# Altium schematic sheet ESC3 (1).SchDoc: Sensorless BLDC Controller
size A3; PageSetup: Record=PageOptions|CenterHorizontal=True|CenterVertical=True|PrintScale=0.34|XCorrection=1.00|YCorrection=1.00|PrintKind=1|BorderSize=5000000|LeftOffset=0|BottomOffset=0|Orientation=2|PaperLength=1000|PaperWidth=1000|Scale=100|PaperSource=7|PrintQuality=-3|MediaType=1|DitherType=10|PrintScaleMode=1|PaperKind=A3|PaperIndex=8
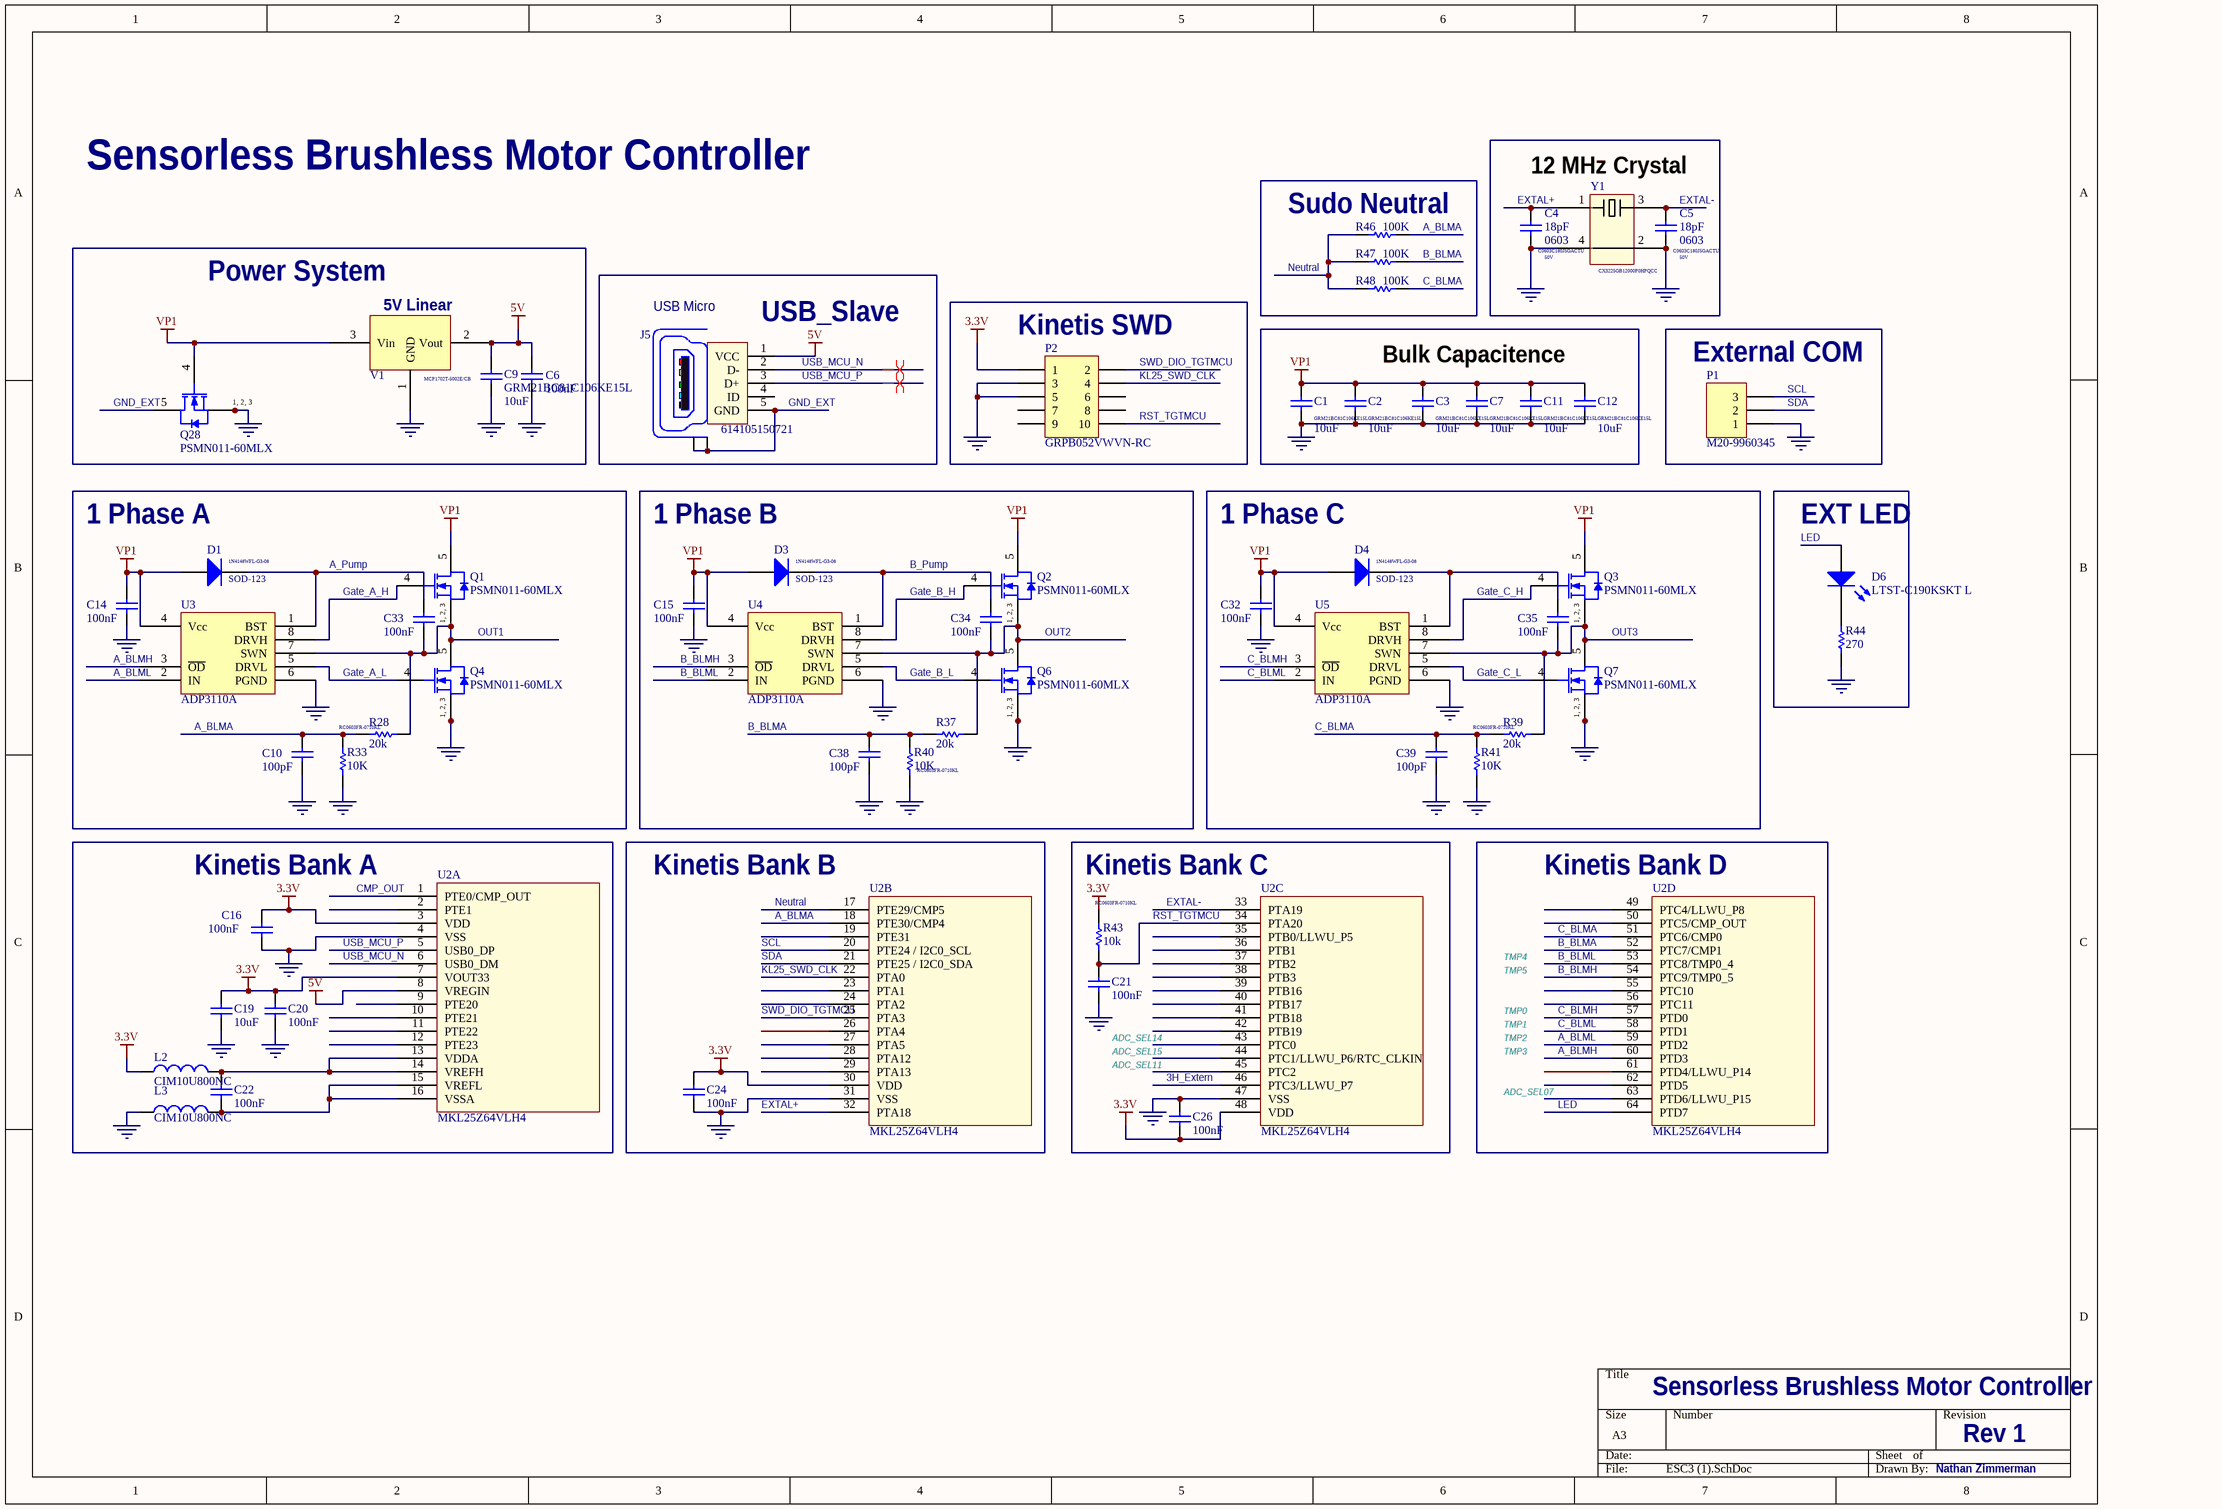
[diagram p0: ESC3 (1).SchDoc]

## Parts
C1  GRM21BC81C106KE15L  value 10uF  [6-0805_MC]
C2  GRM21BC81C106KE15L  value 10uF  [6-0805_MC]
C3  GRM21BC81C106KE15L  value 10uF  [6-0805_MC]
C4  C0603C180J5GACTU  value 18pF  PackageReference: 0603  Voltage: 50V  [1608[0603]C]
C5  C0603C180J5GACTU  value 18pF  PackageReference: 0603  Voltage: 50V  [1608[0603]C]
C6  value 100nF  [1608[0603]C]  (hidden comment: GRM188R71H104KA93D)
C7  GRM21BC81C106KE15L  value 10uF  [6-0805_MC]
C9  GRM21BC81C106KE15L  value 10uF  [6-0805_MC]
C10  value 100pF  [1608[0603]C]  (hidden comment: C1608C0G1H101J080AA)
C11  GRM21BC81C106KE15L  value 10uF  [6-0805_MC]
C12  GRM21BC81C106KE15L  value 10uF  [6-0805_MC]
C14  value 100nF  [1608[0603]C]  (hidden comment: GRM188R71H104KA93D)
C15  value 100nF  [1608[0603]C]  (hidden comment: GRM188R71H104KA93D)
C16  value 100nF  [1608[0603]C]  (hidden comment: GRM188R71H104KA93D)
C19  value 10uF  [6-0805_MC]  (hidden comment: GRM21BC81C106KE15L)
C20  value 100nF  [1608[0603]C]  (hidden comment: GRM188R71H104KA93D)
C21  value 100nF  [1608[0603]C]  (hidden comment: GRM188R71H104KA93D)
C22  value 100nF  [1608[0603]C]  (hidden comment: GRM188R71H104KA93D)
C24  value 100nF  [1608[0603]C]  (hidden comment: GRM188R71H104KA93D)
C26  value 100nF  [1608[0603]C]  (hidden comment: GRM188R71H104KA93D)
C32  value 100nF  [1608[0603]C]  (hidden comment: GRM188R71H104KA93D)
C33  value 100nF  [1608[0603]C]  (hidden comment: GRM188R71H104KA93D)
C34  value 100nF  [1608[0603]C]  (hidden comment: GRM188R71H104KA93D)
C35  value 100nF  [1608[0603]C]  (hidden comment: GRM188R71H104KA93D)
C38  value 100pF  [1608[0603]C]  (hidden comment: C1608C0G1H101J080AA)
C39  value 100pF  [1608[0603]C]  (hidden comment: C1608C0G1H101J080AA)
D1  1N4148WFL-G3-08  PackageReference: SOD-123  [SOD123_3D]
D3  1N4148WFL-G3-08  PackageReference: SOD-123  [SOD123_3D]
D4  1N4148WFL-G3-08  PackageReference: SOD-123  [SOD123_3D]
D6  LTST-C190KSKT L  [1608[0603]LED]
J5  614105150721  [USB_Micro_Vertical]
L2  CIM10U800NC  [1608[0603]L]
L3  CIM10U800NC  [1608[0603]L]
P1  M20-9960345  [HDR1X3]
P2  GRPB052VWVN-RC  [MHDR2X5]
Q1  PSMN011-60MLX  [SOT1210_FET]
Q2  PSMN011-60MLX  [SOT1210_FET]
Q3  PSMN011-60MLX  [SOT1210_FET]
Q4  PSMN011-60MLX  [SOT1210_FET]
Q6  PSMN011-60MLX  [SOT1210_FET]
Q7  PSMN011-60MLX  [SOT1210_FET]
Q28  PSMN011-60MLX  [SOT1210_FET]
R28  value 20k  [1608[0603]R]  (hidden comment: Res1)
R33  RC0603FR-0710KL  value 10K  [1608[0603]R]
R37  value 20k  [1608[0603]R]  (hidden comment: Res1)
R39  value 20k  [1608[0603]R]  (hidden comment: Res1)
R40  RC0603FR-0710KL  value 10K  [1608[0603]R]
R41  RC0603FR-0710KL  value 10K  [1608[0603]R]
R43  RC0603FR-0710KL  value 10k  [1608[0603]R]
R44  value 270  [1608[0603]R]  (hidden comment: Res1)
R46  value 100K  [1608[0603]R]  (hidden comment: Res1)
R47  value 100K  [1608[0603]R]  (hidden comment: Res1)
R48  value 100K  [1608[0603]R]  (hidden comment: Res1)
U2  MKL25Z64VLH4  [LQFP64_10mm_0.5mm]  (parts A,B,C,D of 4)
U3  ADP3110A  [SOIC8_3.9mm_body]
U4  ADP3110A  [SOIC8_3.9mm_body]
U5  ADP3110A  [SOIC8_3.9mm_body]
V1  MCP1702T-5002E/CB  [SOT-23B_M]
Y1  CX3225GB12000P0HPQCC  [3225_Crystal]

## Blocks framed on the sheet
12 MHz Crystal: C4 C5 Y1
Sudo Neutral: R46-R48
Power System: C6 C9 Q28 V1
USB_Slave: J5
Kinetis SWD: P2
Bulk Capacitence: C1-C3 C7 C11 C12
External COM: P1
1 Phase A: C10 C14 C33 D1 Q1 Q4 R28 R33 U3
1 Phase B: C15 C34 C38 D3 Q2 Q6 R37 R40 U4
1 Phase C: C32 C35 C39 D4 Q3 Q7 R39 R41 U5
EXT LED: D6 R44
Kinetis Bank A: C16 C19 C20 C22 L2 L3 U2
Kinetis Bank B: C24 U2
Kinetis Bank C: C21 C26 R43 U2
Kinetis Bank D: U2

## Nets
3.3V: C16.2 C19.1 C20.1 C24.2 C26.1 L2.2 P2.1 R43.2 U2.3(VDD) U2.7(VOUT33) U2.30(VDD) U2.48(VDD)
5V: C6.2 C9.2 J5.1(VCC) U2.8(VREGIN) V1.2(Vout)
GND: C1.1 C2.1 C3.1 C4.1 C5.1 C6.1 C7.1 C9.1 C10.1 C11.1 C12.1 C14.1 C15.1 C16.1 C19.2 C20.2 C21.1 C24.1 C26.2 C32.1 C38.1 C39.1 L3.2 P1.1 P2.3 P2.5 Q4.1(S) Q4.2(S) Q4.3(S) Q6.1(S) Q6.2(S) Q6.3(S) Q7.1(S) Q7.2(S) Q7.3(S) Q28.1(S) Q28.2(S) Q28.3(S) R33.2 R40.2 R41.2 R44.2 U2.4(VSS) U2.31(VSS) U2.47(VSS) U3.6(PGND) U4.6(PGND) U5.6(PGND) V1.1(GND) Y1.2(GND) Y1.4(GND)
VP1: C1.2 C2.2 C3.2 C7.2 C11.2 C12.2 C14.2 C15.2 C32.2 D1.1(A) D3.1(A) D4.1(A) Q1.5(D) Q2.5(D) Q3.5(D) Q28.4(G) U3.4(Vcc) U4.4(Vcc) U5.4(Vcc) V1.3(Vin)
3H_Extern: U2.46(PTC3/LLWU_P7)
A_BLMA: C10.2 R28.2 R33.1 R46.2 U2.18(PTE30/CMP4)
A_BLMH: U2.60(PTD3) U3.3(~{OD})
A_BLML: U2.59(PTD2) U3.2(IN)
A_Pump: C33.2 D1.2(K) U3.1(BST)
B_BLMA: C38.2 R37.2 R40.1 R47.2 U2.52(PTC7/CMP1)
B_BLMH: U2.54(PTC9/TMP0_5) U4.3(~{OD})
B_BLML: U2.53(PTC8/TMP0_4) U4.2(IN)
B_Pump: C34.2 D3.2(K) U4.1(BST)
C_BLMA: C39.2 R39.2 R41.1 R48.2 U2.51(PTC6/CMP0)
C_BLMH: U2.57(PTD0) U5.3(~{OD})
C_BLML: U2.58(PTD1) U5.2(IN)
CMP_OUT: U2.1(PTE0/CMP_OUT)
EXTAL+: C4.2 U2.32(PTA18) Y1.1(X1)
EXTAL-: C5.2 U2.33(PTA19) Y1.3(X2)
Gate_A_H: Q1.4(G) U3.8(DRVH)
Gate_A_L: Q4.4(G) U3.5(DRVL)
Gate_B_H: Q2.4(G) U4.8(DRVH)
Gate_B_L: Q6.4(G) U4.5(DRVL)
Gate_C_H: Q3.4(G) U5.8(DRVH)
Gate_C_L: Q7.4(G) U5.5(DRVL)
GND_EXT: J5.5(GND) J5.Z1(Shield) J5.Z2(Shield) Q28.5(D)
KL25_SWD_CLK: P2.4 U2.22(PTA0)
LED: D6.1(A) U2.64(PTD7)
Neutral: R46.1 R47.1 R48.1 U2.17(PTE29/CMP5)
OUT1: C33.1 Q1.1(S) Q1.2(S) Q1.3(S) Q4.5(D) R28.1 U3.7(SWN)
OUT2: C34.1 Q2.1(S) Q2.2(S) Q2.3(S) Q6.5(D) R37.1 U4.7(SWN)
OUT3: C35.1 Q3.1(S) Q3.2(S) Q3.3(S) Q7.5(D) R39.1 U5.7(SWN)
RST_TGTMCU: C21.2 P2.10 R43.1 U2.34(PTA20)
SCL: P1.3 U2.20(PTE24_/_I2C0_SCL)
SDA: P1.2 U2.21(PTE25_/_I2C0_SDA)
SWD_DIO_TGTMCU: P2.2 U2.25(PTA3)
USB_MCU_N: J5.2(D-) U2.6(USB0_DM)
USB_MCU_P: J5.3(D+) U2.5(USB0_DP)
NetC22_1: C22.1 L3.1 U2.15(VREFL) U2.16(VSSA)
NetC22_2: C22.2 L2.1 U2.13(VDDA) U2.14(VREFH)
NetC35_2: C35.2 D4.2(K) U5.1(BST)
NetD6_2: D6.2(K) R44.1

Not connected (* = marked no-connect by the designer): J5 4(ID); P2 6 7 8 9; U2 2(PTE1) 9(PTE20) 10(PTE21) 11(PTE22) 12(PTE23) 19(PTE31) 23(PTA1) 24(PTA2) 26(PTA4) 27(PTA5) 28(PTA12) 29(PTA13) 35(PTB0/LLWU_P5) 36(PTB1) 37(PTB2) 38(PTB3) 39(PTB16) 40(PTB17) 41(PTB18) 42(PTB19) 43(PTC0) 44(PTC1/LLWU_P6/RTC_CLKIN) 45(PTC2) 49(PTC4/LLWU_P8) 50(PTC5/CMP_OUT) 55(PTC10) 56(PTC11) 61(PTD4/LLWU_P14) 62(PTD5) 63(PTD6/LLWU_P15)

## Layout directives
differential pair: USB_MCU_N, USB_MCU_P

## Notes on the sheet
- Sensorless Brushless Motor Controller
- (near V1) 5V Linear
- (near J5) USB Micro
- TMP4
- TMP5
- ADC_SEL14
- ADC_SEL15
- TMP0
- TMP1
- TMP2
- TMP3
- ADC_SEL11
- ADC_SEL07
- Rev 1
- Nathan Zimmerman
- (in symbol CMP-1258-00026-1) 1, 2, 3

## Library data of the parts
C1-C3 C7 C11 C12 = Cap: Published: 8-Jun-2000; LatestRevisionDate: 17-Jul-2002; LatestRevisionNote: Re-released for DXP Platform.; PackageReference: RAD-0.3; Publisher: Altium Limited; PackageDescription: Radial Cap, Thru-Hole; 2 Leads; 0.3 in Pin Spacing
C4 C5 = Cap Semi: Capacitor (Semiconductor SIM Model); PP1: 0.00610; Page: Micro; PackageDescription: Chip Capacitor; Digikey: 311-1361-1-ND; PP100: 0.00610
C6 C10 C14-C16 C19-C22 C24 C26 C32-C35 C38 C39 = Cap Semi: Capacitor (Semiconductor SIM Model); Published: 8-Jun-2000; LatestRevisionDate: 29-May-2009; LatestRevisionNote: IPC-7351 Footprint Added.; PackageReference: C1206; Publisher: Altium Limited; PackageDescription: Chip Capacitor; Digikey: 311-1361-1-ND
C9 = Cap: Capacitor; Published: 8-Jun-2000; LatestRevisionDate: 17-Jul-2002; LatestRevisionNote: Re-released for DXP Platform.; PackageReference: RAD-0.3; Publisher: Altium Limited; PackageDescription: Radial Cap, Thru-Hole; 2 Leads; 0.3 in Pin Spacing
D1 D3 D4 = Diode 1N4148: High Conductance Fast Diode; PP1: 0.12000; PP100: 0.0742; Page: Digital_IO; Published: 8-Jun-2000; LatestRevisionDate: 17-Jul-2002; LatestRevisionNote: Re-released for DXP Platform.; DatasheetVersion: 1997; Publisher: Altium Limited; PackageDescription: Diode, Axial; Body 3.8 x 1.9 mm (LxDia. max), Lead Dia. 0.53 mm (max); Code_JEDEC: DO-204-AH; ComponentLink1Description: Manufacturer Link; ComponentLink1URL: http://www.fairchildsemi.com/; ComponentLink2Description: Datasheet; ComponentLink2URL: http://www.fairchildsemi.com/ds/1N%2F1N4148.pdf; ClassName: DI_6
D6 = LED3: Typical BLUE SiC LED; Published: 8-Jun-2000; LatestRevisionDate: 17-Dec-2003; LatestRevisionNote: PCB Footprint replaced.; DatasheetVersion: 16-Apr-2002; PackageVersion: 16-Apr-2002; PackageReference: 3.5X2.8X1.9; Publisher: Altium Limited; PackageDescription: SM LED; 2 C-Bend Leads; Body 3.5 x 2.8 x 1.9 mm, inc leads (LxWxH typ)
J5 = WR-Communication Connectors 614105150721: WR-COM_USB_Micro Type B_Vertical_THT; Manufacturer: Würth Elektronik eiSos GmbH; ComponentLink1 Description: Manufacturer; ComponentLink2 Description: Datasheet; NoPins: 5; ComponentLink1URL: http://www.we-online.de; ComponentLink2URL: http://katalog.we-online.de/em/datasheet/614105150721.pdf; Created by: Karrer Zheng; Created Date: 10/25/2014; partNo: 614105150721
L2 L3 = Inductor
P1 = Header 3: Header, 3-Pin; LatestRevisionDate: 17-Jul-2002; LatestRevisionNote: Re-released for DXP Platform.; Publisher: Altium Limited
P2 = Header 5X2: Header, 5-Pin, Dual row; LatestRevisionDate: 17-Jul-2002; LatestRevisionNote: Re-released for DXP Platform.; Publisher: Altium Limited
Q1-Q4 Q6 Q7 Q28 = CMP-1258-00026-1: N-Channel Logic Level MOSFET, 60 V, 61 A, 5-Pin SOT1210, Reel; Manufacturer: NXP Semiconductors; VDS [max] (V): 60; VGSth [typ] (V): 1.7; Coss [typ] (pF): 199; Channel Type: N; Qr [typ] (nC): 15.7; Ciss [typ] (pF): 2191; ID [max] (A): 61; ComponentLink2URL: http://www.nxp.com/documents/data_sheet/PSMN011-60ML.pdf; ComponentLink1Description: Manufacturer URL; PartNumber: PSMN011-60MLX; PackageDescription: 8-Pin Plastic Single-ended Surface Mounted Package, Body 3.3 x 2.6 mm, Pitch 0.65 mm; PackageReference: SOT1210; ComponentLink1URL: http://www.nxp.com/; PackageVersion: 14-04-25, 04/2014; ComponentLink3Description: Package Specification; ComponentLink3URL: http://www.nxp.com/documents/outline_drawing/sot1210_po.pdf; Packing: Reel; Mounting Technology: Surface Mount; ComponentLink2Description: Datasheet
R28 R33 R37 R39-R41 R43 R44 R46-R48 = Res1: Resistor; Published: 8-Jun-2000; LatestRevisionDate: 17-Jul-2002; LatestRevisionNote: Re-released for DXP Platform.; PackageReference: AXIAL-0.3; Publisher: Altium Limited; PackageDescription: Axial Device, Thru-Hole; 2 Leads; 0.3 in Pin Spacing
U2 = MKL25Z64VLH4: MKL25Z64VLH4 MCU
V1 = MCP1700: MCP1700 3.3V REG
Y1 = 12MHz_Crystal: 12MHz Micro Crystal; PP1: 0.64000; PP100: 0.47000; Value: 12MHz; Page: Micro